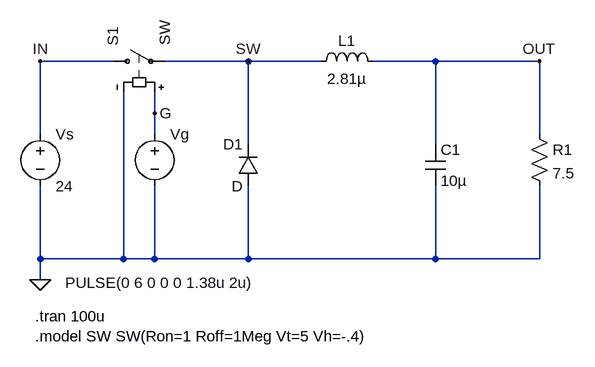
[diagram p0: schematic boost_converter.asc]
boost_converter.asc, the LTspice schematic file:
Version 4
SHEET 1 880 680
WIRE 96 32 -16 32
WIRE 304 32 176 32
WIRE 416 32 304 32
WIRE 592 32 496 32
WIRE 752 32 592 32
WIRE 160 112 160 80
WIRE -16 144 -16 32
WIRE 160 144 160 112
WIRE 752 144 752 32
WIRE 304 160 304 32
WIRE 592 160 592 32
WIRE -16 336 -16 224
WIRE 112 336 112 80
WIRE 112 336 -16 336
WIRE 160 336 160 224
WIRE 160 336 112 336
WIRE 304 336 304 224
WIRE 304 336 160 336
WIRE 592 336 592 224
WIRE 592 336 304 336
WIRE 752 336 752 224
WIRE 752 336 592 336
WIRE -16 368 -16 336
FLAG -16 368 0
FLAG 752 32 OUT
FLAG -16 32 IN
FLAG 304 32 SW
FLAG 160 112 G
SYMBOL voltage -16 128 R0
WINDOW 123 0 0 Left 2
WINDOW 39 0 0 Left 2
SYMATTR InstName Vs
SYMATTR Value 24
SYMBOL sw 80 32 R270
SYMATTR InstName S1
SYMBOL diode 320 224 R180
WINDOW 0 24 64 Left 2
WINDOW 3 24 0 Left 2
SYMATTR InstName D1
SYMBOL ind 400 48 R270
WINDOW 0 32 56 VTop 2
WINDOW 3 5 56 VBottom 2
SYMATTR InstName L1
SYMATTR Value 2.81µ
SYMBOL cap 576 160 R0
SYMATTR InstName C1
SYMATTR Value 10µ
SYMBOL res 736 128 R0
SYMATTR InstName R1
SYMATTR Value 7.5
SYMBOL voltage 160 128 R0
WINDOW 3 -138 245 Left 2
WINDOW 123 0 0 Left 2
WINDOW 39 0 0 Left 2
SYMATTR Value PULSE(0 6 0 0 0 1.38u 2u)
SYMATTR InstName Vg
TEXT -24 424 Left 2 !.tran 100u\n.model SW SW(Ron=1 Roff=1Meg Vt=5 Vh=-.4)

The netlist it stands for:
* boost_converter.asc
Vs IN 0 24
S1 IN SW G 0 SW
D1 0 SW D
L1 SW OUT 2.81µ
C1 OUT 0 10µ
R1 OUT 0 7.5
Vg G 0 PULSE(0 6 0 0 0 1.38u 2u)
.model D D
.lib standard.dio
.tran 100u
.model SW SW(Ron=1 Roff=1Meg Vt=5 Vh=-.4)
.backanno
.end